# Altium schematic sheet ESP32_Module.SchDoc
size 431 x 279 mm; Organization: ORGANIZATION; Address1: ADDRESS 1; Address2: ADDRESS 2; Address3: ADDRESS 3; Address4: ADDRESS 4; Revision: -; SheetNumber: 4; SheetTotal: 4; ENG_APP_DATE: --/--/--; DSN_APP_DATE: --/--/--; CHK_APP_DATE: --/--/--
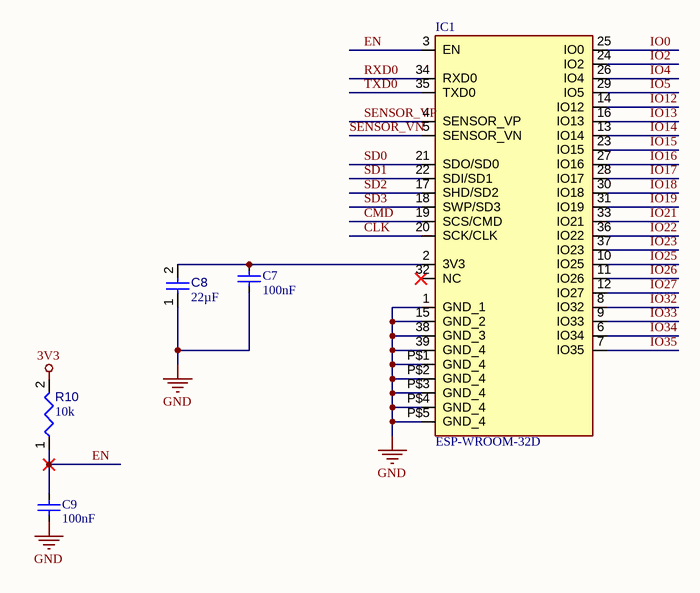
[diagram p0: ESP32_Module.SchDoc]

## Parts
C7  value 100nF  [0603C_L]  (hidden comment: Cap100nF_50V_0603)
C8  value 22µF  [CAPC0805(2012)145_L]  (hidden comment: Capacitor 22µF +/-40% 16V 0805)
C9  value 100nF  [0603C_L]  (hidden comment: Cap100nF_50V_0603)
IC1  ESP-WROOM-32D  [ESPWROOM32D]
R10  value 10k  [RESC0402(1005)_L]  (hidden comment: Resistor 10K  +/-1 % 0402 63 mW)

## Nets
3V3: R10.2
GND: C7.1 C8.1 C9.1 IC1.1(GND_1) IC1.15(GND_2) IC1.38(GND_3) IC1.39(GND_4) IC1.P$1(GND_4) IC1.P$2(GND_4) IC1.P$3(GND_4) IC1.P$4(GND_4) IC1.P$5(GND_4)
CLK: IC1.20(SCK/CLK)
CMD: IC1.19(SCS/CMD)
EN: C9.2 IC1.3(EN) R10.1
IO0: IC1.25(IO0)
IO2: IC1.24(IO2)
IO4: IC1.26(IO4)
IO5: IC1.29(IO5)
IO12: IC1.14(IO12)
IO13: IC1.16(IO13)
IO14: IC1.13(IO14)
IO15: IC1.23(IO15)
IO16: IC1.27(IO16)
IO17: IC1.28(IO17)
IO18: IC1.30(IO18)
IO19: IC1.31(IO19)
IO21: IC1.33(IO21)
IO22: IC1.36(IO22)
IO23: IC1.37(IO23)
IO25: IC1.10(IO25)
IO26: IC1.11(IO26)
IO27: IC1.12(IO27)
IO32: IC1.8(IO32)
IO33: IC1.9(IO33)
IO34: IC1.6(IO34)
IO35: IC1.7(IO35)
RXD0: IC1.34(RXD0)
SD0: IC1.21(SDO/SD0)
SD1: IC1.22(SDI/SD1)
SD2: IC1.17(SHD/SD2)
SD3: IC1.18(SWP/SD3)
SENSOR_VN: IC1.5(SENSOR_VN)
SENSOR_VP: IC1.4(SENSOR_VP)
TXD0: IC1.35(TXD0)
NetC7_2: C7.2 C8.2 IC1.2(3V3)

Not connected (* = marked no-connect by the designer): IC1 32(NC)*

## Notes on the sheet
- DWG. NO.
- REV.
- SHT.
- THIS DOCUMENT AND THE DATA DISCLOSED HEREIN OR HEREWITH IS THE PROPERTY OF ALTIUM LIMITED AND MAY BE FREELY DISTRIBUTED IN WHOLE. NO RIGHTS ARE RESERVED OR EXPRESS OR IMPLIED WARANTEE GIVEN.
- REVISION
- DESCRIPTION
- DATE
- APPROVED
- ENG:
- DSN:
- APPROVALS
- PROJECT REVISION:
- www.altium.com <http://www.altium.com>
- DOCUMENT REVISION:
- 92037, La Jolla
- USA
- Altium Ltd.
- 4225 Executive Square
- CHK:
- REFERENCE DOCUMENTS
- DESIGN ITEM:
- TITLE
- VARIANT
- BOM:
- FAB DWG:
- PCB DWG:
- ASSY DWG:
- SCALE:
- SIZE
- B
- CAGE CODE
- FILE NAME
- DWG NO.
- SHEET
- OF
- REV

## Library data of the parts
C7 C9 = CMP-001-00084-1: Ceramic Capacitor, Multilayer, Ceramic, 50V, 80% +Tol, 20% -Tol, Y5V, -82/+22% TC, 0.1uF, Surface Mount, 0603; Manufacturer: Yageo; Manufacturer Part Number: CC0603ZRY5V9BB104; Multilayer: Yes; Source: WCT.SCHLIB; Voltage Rating: 50V; Design Item ID: Cap100nF_50V_0603; Tolerance (fill in as +-): 80%; Packaging: Tape and Reel; Mounting Technology: Surface Mount; Pins: 2; Termination: Wraparound; Capacitor Type: Ceramic; Height: 0.8mm; Reach SVHC Compliant: Yes; Rated DC Voltage (URdc): 50V; RoHS Compliant: Yes; Package Style: SMTMeter; Tolerance  (fill in as +-): 20%; Length: 1.6mm; Case/Package: 0603; JESD-609 Code: e3; Component Type: Capacitors; Terminal Finish: Nickel; Max Operating Temperature: 85°C; Min Operating Temperature: -30°C; Dielectric Material: Ceramic; Temperature Characteristics Code: Y5V; Package Shape: Rectangular; Width: 0.8mm
C8 = CMP-001-00081-4: Chip Capacitor, 22µF +/-40%, 16V, 0805, Thickness 1.45 mm; Tolerance: 5%; Voltage Rating: 16V; Mounting Technology: SMT; Pins: 2; Max Operating Temperature: 85°C; Case/Package: 0805; Min Operating Temperature: -55°C
IC1 = ESP-WROOM-32D: WiFi / 802.11 Modules; MF: Espressif Systems; SnapEDA_Link: https://www.snapeda.com/parts/ESP-WROOM-32D/Espressif+Systems/view-part/?ref=snap; Package: None; Value: *; MP: ESP-WROOM-32D; Check_prices: https://www.snapeda.com/parts/ESP-WROOM-32D/Espressif+Systems/view-part/?ref=eda
R10 = CMP-009-00149-3: Chip Resistor, 10 kOhms, +/-1 %, 63 mW, -55 to 125 degC, 0402; Power: 63mW; Tolerance: 1%; Min Operating Temperature: -55°C; Case/Package: 0402; Max Operating Temperature: 155°C; Pins: 2